# Altium schematic sheet lockdriver(7805).SchDoc
size A2
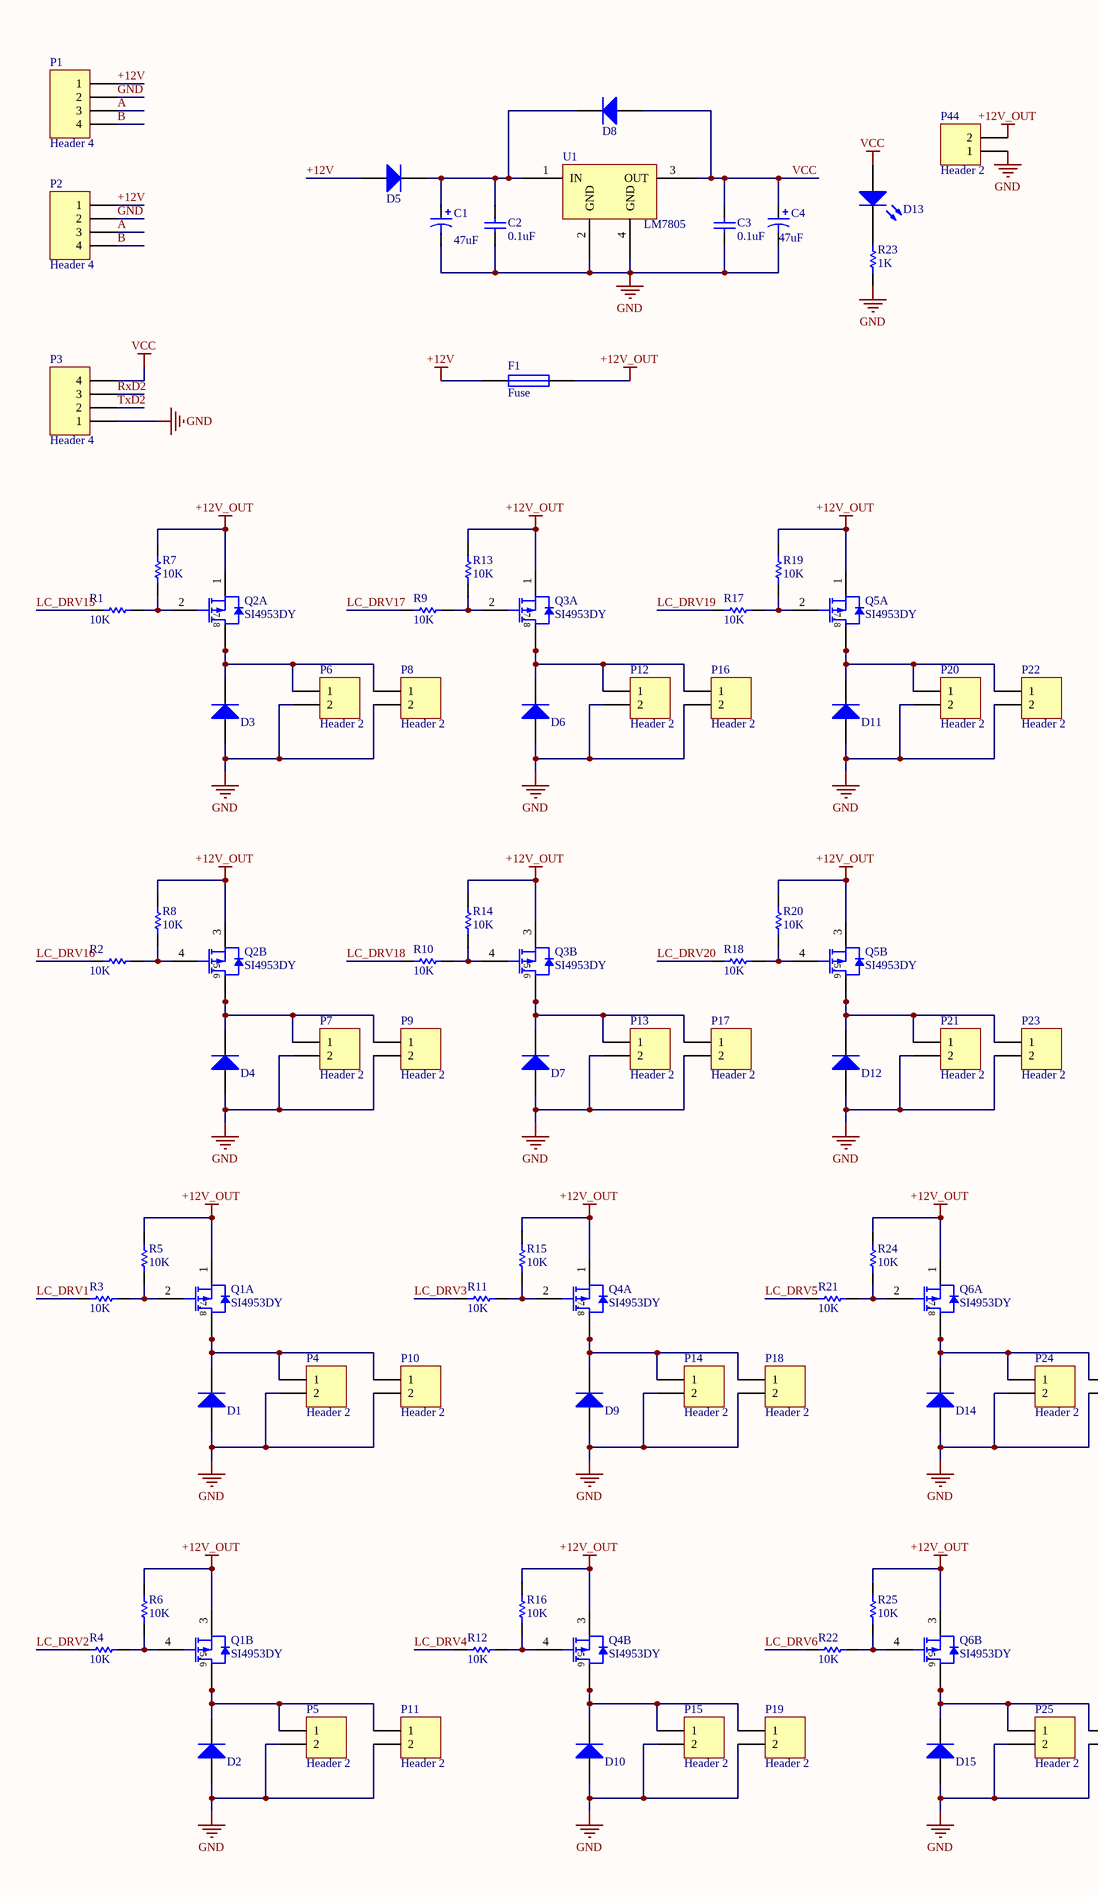
[diagram p0: lockdriver(7805).SchDoc, left]
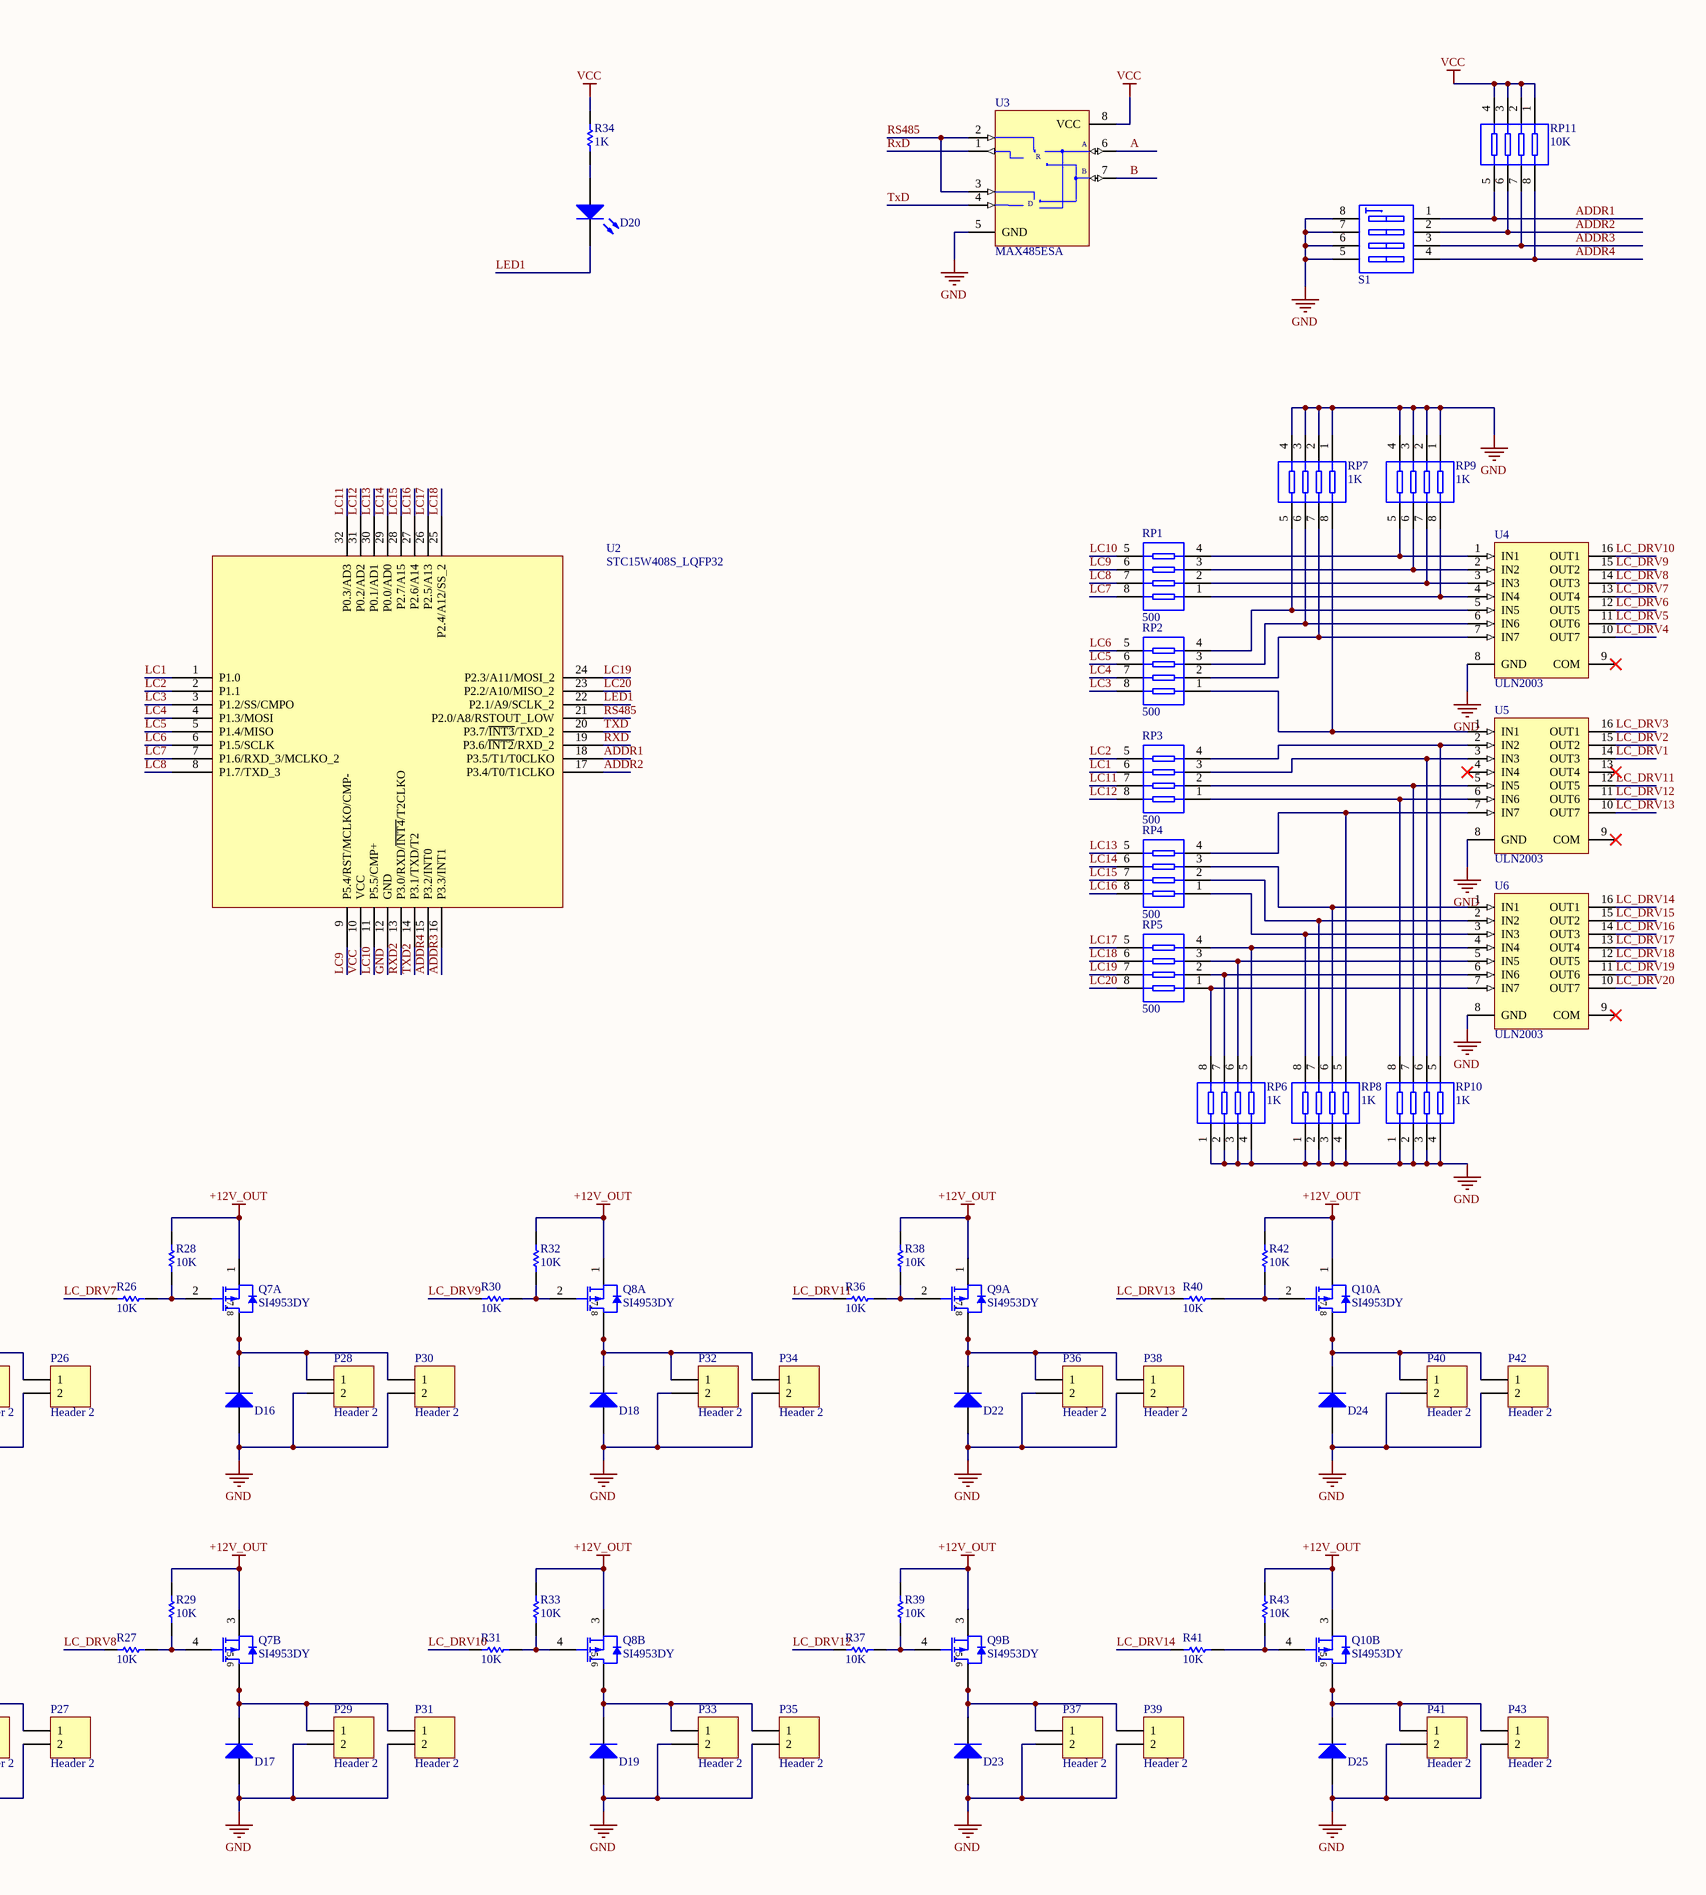
[diagram p1: lockdriver(7805).SchDoc, right]

## Parts
C1  value 47uF  [CAPPR2-5x11.5]  (hidden comment: Cap Pol2)
C2  0.1uF  [CAPC2012M]
C3  0.1uF  [CAPC2012M]
C4  value 47uF  [CAPPR2-5x11.5]  (hidden comment: Cap Pol2)
D1  1N4007  [DSO-C2/X1.8]  (value not drawn)
D2  1N4007  [DSO-C2/X1.8]  (value not drawn)
D3  1N4007  [DSO-C2/X1.8]  (value not drawn)
D4  1N4007  [DSO-C2/X1.8]  (value not drawn)
D5  1N4007  [DSO-C2/X1.8]  (value not drawn)
D6  1N4007  [DSO-C2/X1.8]  (value not drawn)
D7  1N4007  [DSO-C2/X1.8]  (value not drawn)
D8  1N4007  [DSO-C2/X1.8]  (value not drawn)
D9  1N4007  [DSO-C2/X1.8]  (value not drawn)
D10  1N4007  [DSO-C2/X1.8]  (value not drawn)
D11  1N4007  [DSO-C2/X1.8]  (value not drawn)
D12  1N4007  [DSO-C2/X1.8]  (value not drawn)
D13  LED  [LED2012M]  (value not drawn)
D14  1N4007  [DSO-C2/X1.8]  (value not drawn)
D15  1N4007  [DSO-C2/X1.8]  (value not drawn)
D16  1N4007  [DSO-C2/X1.8]  (value not drawn)
D17  1N4007  [DSO-C2/X1.8]  (value not drawn)
D18  1N4007  [DSO-C2/X1.8]  (value not drawn)
D19  1N4007  [DSO-C2/X1.8]  (value not drawn)
D20  LED  [LED2012M]  (value not drawn)
D22  1N4007  [DSO-C2/X1.8]  (value not drawn)
D23  1N4007  [DSO-C2/X1.8]  (value not drawn)
D24  1N4007  [DSO-C2/X1.8]  (value not drawn)
D25  1N4007  [DSO-C2/X1.8]  (value not drawn)
F1  Fuse  [SR075]
P1  Header 4  [VH396-4]
P2  Header 4  [VH396-4]
P3  Header 4  [HDR1X4]
P4  Header 2  [VH396-2]
P5  Header 2  [VH396-2]
P6  Header 2  [VH396-2]
P7  Header 2  [VH396-2]
P8  Header 2  [XH254-2]
P9  Header 2  [XH254-2]
P10  Header 2  [XH254-2]
P11  Header 2  [XH254-2]
P12  Header 2  [VH396-2]
P13  Header 2  [VH396-2]
P14  Header 2  [VH396-2]
P15  Header 2  [VH396-2]
P16  Header 2  [XH254-2]
P17  Header 2  [XH254-2]
P18  Header 2  [XH254-2]
P19  Header 2  [XH254-2]
P20  Header 2  [VH396-2]
P21  Header 2  [VH396-2]
P22  Header 2  [XH254-2]
P23  Header 2  [XH254-2]
P24  Header 2  [VH396-2]
P25  Header 2  [VH396-2]
P26  Header 2  [XH254-2]
P27  Header 2  [XH254-2]
P28  Header 2  [VH396-2]
P29  Header 2  [VH396-2]
P30  Header 2  [XH254-2]
P31  Header 2  [XH254-2]
P32  Header 2  [VH396-2]
P33  Header 2  [VH396-2]
P34  Header 2  [XH254-2]
P35  Header 2  [XH254-2]
P36  Header 2  [VH396-2]
P37  Header 2  [VH396-2]
P38  Header 2  [XH254-2]
P39  Header 2  [XH254-2]
P40  Header 2  [VH396-2]
P41  Header 2  [VH396-2]
P42  Header 2  [XH254-2]
P43  Header 2  [XH254-2]
P44  Header 2  [VH396-2]
Q1  SI4953DY  [SO8_M]  (parts A,B of 2)
Q2  SI4953DY  [SO8_M]  (parts A,B of 2)
Q3  SI4953DY  [SO8_M]  (parts A,B of 2)
Q4  SI4953DY  [SO8_M]  (parts A,B of 2)
Q5  SI4953DY  [SO8_M]  (parts A,B of 2)
Q6  SI4953DY  [SO8_M]  (parts A,B of 2)
Q7  SI4953DY  [SO8_M]  (parts A,B of 2)
Q8  SI4953DY  [SO8_M]  (parts A,B of 2)
Q9  SI4953DY  [SO8_M]  (parts A,B of 2)
Q10  SI4953DY  [SO8_M]  (parts A,B of 2)
R1  10K  [RESC2012M]
R2  10K  [RESC2012M]
R3  10K  [RESC2012M]
R4  10K  [RESC2012M]
R5  10K  [RESC2012M]
R6  10K  [RESC2012M]
R7  10K  [RESC2012M]
R8  10K  [RESC2012M]
R9  10K  [RESC2012M]
R10  10K  [RESC2012M]
R11  10K  [RESC2012M]
R12  10K  [RESC2012M]
R13  10K  [RESC2012M]
R14  10K  [RESC2012M]
R15  10K  [RESC2012M]
R16  10K  [RESC2012M]
R17  10K  [RESC2012M]
R18  10K  [RESC2012M]
R19  10K  [RESC2012M]
R20  10K  [RESC2012M]
R21  10K  [RESC2012M]
R22  10K  [RESC2012M]
R23  1K  [RESC2012M]
R24  10K  [RESC2012M]
R25  10K  [RESC2012M]
R26  10K  [RESC2012M]
R27  10K  [RESC2012M]
R28  10K  [RESC2012M]
R29  10K  [RESC2012M]
R30  10K  [RESC2012M]
R31  10K  [RESC2012M]
R32  10K  [RESC2012M]
R33  10K  [RESC2012M]
R34  1K  [RESC2012M]
R36  10K  [RESC2012M]
R37  10K  [RESC2012M]
R38  10K  [RESC2012M]
R39  10K  [RESC2012M]
R40  10K  [RESC2012M]
R41  10K  [RESC2012M]
R42  10K  [RESC2012M]
R43  10K  [RESC2012M]
RP1  500  [EXB38V]
RP2  500  [EXB38V]
RP3  500  [EXB38V]
RP4  500  [EXB38V]
RP5  500  [EXB38V]
RP6  1K  [EXB38V]
RP7  1K  [EXB38V]
RP8  1K  [EXB38V]
RP9  1K  [EXB38V]
RP10  1K  [EXB38V]
RP11  10K  [EXB38V]
S1  SW DIP-4  [SWITCH-8]  (value not drawn)
U1  LM7805  [SOT223-4M]
U2  STC15W408S_LQFP32  [LQFP32]
U3  MAX485ESA  [SO8_M]
U4  ULN2003  [SO16_M]
U5  ULN2003  [SO16_M]
U6  ULN2003  [SO16_M]

## Nets
+12V: D5.1(A) F1.1 P1.1 P2.1
+12V_OUT: F1.2 P44.2 Q1.1(S) Q1.3(S) Q2.1(S) Q2.3(S) Q3.1(S) Q3.3(S) Q4.1(S) Q4.3(S) Q5.1(S) Q5.3(S) Q6.1(S) Q6.3(S) Q7.1(S) Q7.3(S) Q8.1(S) Q8.3(S) Q9.1(S) Q9.3(S) Q10.1(S) Q10.3(S) R5.2 R6.2 R7.2 R8.2 R13.2 R14.2 R15.2 R16.2 R19.2 R20.2 R24.2 R25.2 R28.2 R29.2 R32.2 R33.2 R38.2 R39.2 R42.2 R43.2
GND: C1.2 C2.1 C3.2 C4.2 D1.1(A) D2.1(A) D3.1(A) D4.1(A) D6.1(A) D7.1(A) D9.1(A) D10.1(A) D11.1(A) D12.1(A) D14.1(A) D15.1(A) D16.1(A) D17.1(A) D18.1(A) D19.1(A) D22.1(A) D23.1(A) D24.1(A) D25.1(A) P1.2 P2.2 P3.1 P4.2 P5.2 P6.2 P7.2 P8.2 P9.2 P10.2 P11.2 P12.2 P13.2 P14.2 P15.2 P16.2 P17.2 P18.2 P19.2 P20.2 P21.2 P22.2 P23.2 P24.2 P25.2 P26.2 P27.2 P28.2 P29.2 P30.2 P31.2 P32.2 P33.2 P34.2 P35.2 P36.2 P37.2 P38.2 P39.2 P40.2 P41.2 P42.2 P43.2 P44.1 R23.1 RP6.1 RP6.2 RP6.3 RP6.4 RP7.1 RP7.2 RP7.3 RP7.4 RP8.1 RP8.2 RP8.3 RP8.4 RP9.1 RP9.2 RP9.3 RP9.4 RP10.1 RP10.2 RP10.3 RP10.4 S1.5(B4) S1.6(B3) S1.7(B2) S1.8(B1) U1.2(GND) U1.4(GND) U2.12(GND) U3.5(GND) U4.8(GND) U5.8(GND) U6.8(GND)
VCC: C3.1 C4.1 D8.1(A) D13.1(A) P3.4 R34.2 RP11.1 RP11.2 RP11.3 RP11.4 U1.3(OUT) U2.10(VCC) U3.8(VCC)
A: P1.3 P2.3 U3.6(A)
ADDR1: RP11.5 S1.1(A1) U2.18(P3.5/T1/T0CLKO)
ADDR2: RP11.6 S1.2(A2) U2.17(P3.4/T0/T1CLKO)
ADDR3: RP11.7 S1.3(A3) U2.16(P3.3/INT1)
ADDR4: RP11.8 S1.4(A4) U2.15(P3.2/INT0)
B: P1.4 P2.4 U3.7(B)
LC1: RP3.6 U2.1(P1.0)
LC2: RP3.5 U2.2(P1.1)
LC3: RP2.8 U2.3(P1.2/SS/CMPO)
LC4: RP2.7 U2.4(P1.3/MOSI)
LC5: RP2.6 U2.5(P1.4/MISO)
LC6: RP2.5 U2.6(P1.5/SCLK)
LC7: RP1.8 U2.7(P1.6/RXD_3/MCLKO_2)
LC8: RP1.7 U2.8(P1.7/TXD_3)
LC9: RP1.6 U2.9(P5.4/RST/MCLKO/CMP-)
LC10: RP1.5 U2.11(P5.5/CMP+)
LC11: RP3.7 U2.32(P0.3/AD3)
LC12: RP3.8 U2.31(P0.2/AD2)
LC13: RP4.5 U2.30(P0.1/AD1)
LC14: RP4.6 U2.29(P0.0/AD0)
LC15: RP4.7 U2.28(P2.7/A15)
LC16: RP4.8 U2.27(P2.6/A14)
LC17: RP5.5 U2.26(P2.5/A13)
LC18: RP5.6 U2.25(P2.4/A12/SS_2)
LC19: RP5.7 U2.24(P2.3/A11/MOSI_2)
LC20: RP5.8 U2.23(P2.2/A10/MISO_2)
LC_DRV1: R3.1 U5.14(OUT3)
LC_DRV2: R4.1 U5.15(OUT2)
LC_DRV3: R11.1 U5.16(OUT1)
LC_DRV4: R12.1 U4.10(OUT7)
LC_DRV5: R21.1 U4.11(OUT6)
LC_DRV6: R22.1 U4.12(OUT5)
LC_DRV7: R26.1 U4.13(OUT4)
LC_DRV8: R27.1 U4.14(OUT3)
LC_DRV9: R30.1 U4.15(OUT2)
LC_DRV10: R31.1 U4.16(OUT1)
LC_DRV11: R36.1 U5.12(OUT5)
LC_DRV12: R37.1 U5.11(OUT6)
LC_DRV13: R40.1 U5.10(OUT7)
LC_DRV14: R41.1 U6.16(OUT1)
LC_DRV15: R1.1 U6.15(OUT2)
LC_DRV16: R2.1 U6.14(OUT3)
LC_DRV17: R9.1 U6.13(OUT4)
LC_DRV18: R10.1 U6.12(OUT5)
LC_DRV19: R17.1 U6.11(OUT6)
LC_DRV20: R18.1 U6.10(OUT7)
LED1: D20.2(K) U2.22(P2.1/A9/SCLK_2)
RS485: U2.21(P2.0/A8/RSTOUT_LOW) U3.2(~{RE}) U3.3(DE)
RxD: U2.19(P3.6/~{INT2}/RXD_2) U3.1(RO)
RxD2: P3.3 U2.13(P3.0/RXD/~{INT4}/T2CLKO)
TxD: U2.20(P3.7/~{INT3}/TXD_2) U3.4(DI)
TxD2: P3.2 U2.14(P3.1/TXD/T2)
NetC1_1: C1.1 C2.2 D5.2(K) D8.2(K) U1.1(IN)
NetD1_2: D1.2(K) P4.1 P10.1 Q1.7(D) Q1.8(D)
NetD2_2: D2.2(K) P5.1 P11.1 Q1.5(D) Q1.6(D)
NetD3_2: D3.2(K) P6.1 P8.1 Q2.7(D) Q2.8(D)
NetD4_2: D4.2(K) P7.1 P9.1 Q2.5(D) Q2.6(D)
NetD6_2: D6.2(K) P12.1 P16.1 Q3.7(D) Q3.8(D)
NetD7_2: D7.2(K) P13.1 P17.1 Q3.5(D) Q3.6(D)
NetD9_2: D9.2(K) P14.1 P18.1 Q4.7(D) Q4.8(D)
NetD10_2: D10.2(K) P15.1 P19.1 Q4.5(D) Q4.6(D)
NetD11_2: D11.2(K) P20.1 P22.1 Q5.7(D) Q5.8(D)
NetD12_2: D12.2(K) P21.1 P23.1 Q5.5(D) Q5.6(D)
NetD13_2: D13.2(K) R23.2
NetD14_2: D14.2(K) P24.1 P26.1 Q6.7(D) Q6.8(D)
NetD15_2: D15.2(K) P25.1 P27.1 Q6.5(D) Q6.6(D)
NetD16_2: D16.2(K) P28.1 P30.1 Q7.7(D) Q7.8(D)
NetD17_2: D17.2(K) P29.1 P31.1 Q7.5(D) Q7.6(D)
NetD18_2: D18.2(K) P32.1 P34.1 Q8.7(D) Q8.8(D)
NetD19_2: D19.2(K) P33.1 P35.1 Q8.5(D) Q8.6(D)
NetD20_1: D20.1(A) R34.1
NetD22_2: D22.2(K) P36.1 P38.1 Q9.7(D) Q9.8(D)
NetD23_2: D23.2(K) P37.1 P39.1 Q9.5(D) Q9.6(D)
NetD24_2: D24.2(K) P40.1 P42.1 Q10.7(D) Q10.8(D)
NetD25_2: D25.2(K) P41.1 P43.1 Q10.5(D) Q10.6(D)
NetQ1_2: Q1.2(G) R3.2 R5.1
NetQ1_4: Q1.4(G) R4.2 R6.1
NetQ2_2: Q2.2(G) R1.2 R7.1
NetQ2_4: Q2.4(G) R2.2 R8.1
NetQ3_2: Q3.2(G) R9.2 R13.1
NetQ3_4: Q3.4(G) R10.2 R14.1
NetQ4_2: Q4.2(G) R11.2 R15.1
NetQ4_4: Q4.4(G) R12.2 R16.1
NetQ5_2: Q5.2(G) R17.2 R19.1
NetQ5_4: Q5.4(G) R18.2 R20.1
NetQ6_2: Q6.2(G) R21.2 R24.1
NetQ6_4: Q6.4(G) R22.2 R25.1
NetQ7_2: Q7.2(G) R26.2 R28.1
NetQ7_4: Q7.4(G) R27.2 R29.1
NetQ8_2: Q8.2(G) R30.2 R32.1
NetQ8_4: Q8.4(G) R31.2 R33.1
NetQ9_2: Q9.2(G) R36.2 R38.1
NetQ9_4: Q9.4(G) R37.2 R39.1
NetQ10_2: Q10.2(G) R40.2 R42.1
NetQ10_4: Q10.4(G) R41.2 R43.1
NetRP1_1: RP1.1 RP9.8 U4.4(IN4)
NetRP1_2: RP1.2 RP9.7 U4.3(IN3)
NetRP1_3: RP1.3 RP9.6 U4.2(IN2)
NetRP1_4: RP1.4 RP9.5 U4.1(IN1)
NetRP2_1: RP2.1 RP7.8 U5.1(IN1)
NetRP2_2: RP2.2 RP7.7 U4.7(IN7)
NetRP2_3: RP2.3 RP7.6 U4.6(IN6)
NetRP2_4: RP2.4 RP7.5 U4.5(IN5)
NetRP3_1: RP3.1 RP10.8 U5.6(IN6)
NetRP3_2: RP3.2 RP10.7 U5.5(IN5)
NetRP3_3: RP3.3 RP10.6 U5.3(IN3)
NetRP3_4: RP3.4 RP10.5 U5.2(IN2)
NetRP4_1: RP4.1 RP8.8 U6.3(IN3)
NetRP4_2: RP4.2 RP8.7 U6.2(IN2)
NetRP4_3: RP4.3 RP8.6 U6.1(IN1)
NetRP4_4: RP4.4 RP8.5 U5.7(IN7)
NetRP5_1: RP5.1 RP6.8 U6.7(IN7)
NetRP5_2: RP5.2 RP6.7 U6.6(IN6)
NetRP5_3: RP5.3 RP6.6 U6.5(IN5)
NetRP5_4: RP5.4 RP6.5 U6.4(IN4)

Not connected (* = marked no-connect by the designer): U4 9(COM)*; U5 4(IN4)* 9(COM)* 13(OUT4)*; U6 9(COM)*

## Notes on the sheet
- (in symbol MAX485ESA) R; D
- (in symbol SI4953DY, part A) 7, 8
- (in symbol SI4953DY, part B) 5, 6

## Library data of the parts
C1 C4 = Cap Pol2: Polarized Capacitor (22uf-47uf); Published: 8-Jun-2000; LatestRevisionDate: 17-Jul-2002; LatestRevisionNote: Re-released for DXP Platform.; Publisher: Altium Limited; PackageDescription: Polarized Capacitor; 2 Leads
C2 C3 = Cap: Capacitor; Published: 8-Jun-2000; LatestRevisionDate: 17-Jul-2002; LatestRevisionNote: Re-released for DXP Platform.; PackageReference: RAD-0.3; Publisher: Altium Limited; PackageDescription: Radial Cap, Thru-Hole; 2 Leads; 0.3 in Pin Spacing; Value: 0.1uF
D1-D12 D14-D19 D22-D25 = Diode: Default Diode; Published: 8-Jun-2000; LatestRevisionDate: 17-Jul-2002; LatestRevisionNote: Re-released for DXP Platform.; PackageVersion: Sep-1996; PackageReference: SMC; Publisher: Altium Limited; PackageDescription: DO-214-AB/SMC; 2 C-Bend Leads; Body 7.9 x 5.9 mm, inc. leads (LxW); Code_JEDEC: DO-214-AB; Value: 1N4007
D13 D20 = LED: Typical INFRARED GaAs LED; Published: 8-Jun-2000; LatestRevisionDate: 08-Jul-2005; LatestRevisionNote: Mech Layer 1 removed.; PackageReference: LED-0; Publisher: Altium Limited; PackageDescription: LED; 2 Leads
P1-P3 = Header 4: Header, 4-Pin; LatestRevisionDate: 17-Jul-2002; LatestRevisionNote: Re-released for DXP Platform.; Publisher: Altium Limited
P4-P44 = Header 2: Header, 2-Pin; LatestRevisionDate: 17-Jul-2002; LatestRevisionNote: Re-released for DXP Platform.; Publisher: Altium Limited
Q1-Q10 = SI4953DY: Dual P-Channel 30V (D-S) Rated  MOSFET; Published: 8-Jun-2000; LatestRevisionDate: 13-Apr-2006; LatestRevisionNote: IPC-7351 Footprint Added.; DatasheetVersion: 6-Oct-1997; PackageVersion: Aug-1998; PackageReference: SO-8; Publisher: Altium Limited; PackageDescription: 8-Pin Small Outline Integrated Circuit 1.27 mm Pitch; ComponentLink1Description: Manufacturer Link; ComponentLink1URL: http://www.vishay.com/; ComponentLink2Description: Datasheet; ComponentLink2URL: http://www.vishay.com/docs/70153/70153.pdf
R1-R34 R36-R43 = Res: Resistor; Published: 8-Jun-2000; LatestRevisionDate: 17-Jul-2002; LatestRevisionNote: Re-released for DXP Platform.; PackageReference: AXIAL-0.3; Publisher: Altium Limited; PackageDescription: Axial Device, Thru-Hole; 2 Leads; 0.3 in Pin Spacing
  R1-R22 R24-R33 R36-R43: Value: 10K
  R23 R34: Value: 1K
RP1-RP11 = Res Pack
  RP1-RP5: Value: 500
  RP6-RP10: Value: 1K
  RP11: Value: 10K
S1 = SW DIP-4: DIP Switch, 4 Position, SPST; Published: 24-Mar-1999; LatestRevisionDate: 29-May-2009; LatestRevisionNote: IPC-7351 Footprint Added.; PackageVersion: Dec-2002; PackageReference: SO8; Publisher: Altium Limited; PackageDescription: 8-Pin Small Outline Integrated Circuit 1.27 mm Pitch; Code_JEDEC: MS-012-AA; Code_IPC: SOIC127P600-8
U3 = MAX485ESA: Low-Power, Slew-Rate-Limited RS-485/RS-422 Transceiver; Published: 16-Jan-2001; LatestRevisionDate: 13-Apr-2006; LatestRevisionNote: IPC-7351 Footprint Added.; DatasheetVersion: Feb-1996; PackageReference: NSO8; Publisher: Altium Limited; PackageDescription: 8-Pin Small Outline Integrated Circuit 1.27 mm Pitch; Code_JEDEC: MS-012-AA; Code_IPC: SOIC127P600-8; ComponentLink1Description: Manufacturer Link; ComponentLink1URL: http://www.maxim-ic.com/; ComponentLink2Description: Datasheet; ComponentLink2URL: http://pdfserv.maxim-ic.com/en/ds/MAX1487-MAX491.pdf
U4-U6 = ULN2003: Seven Darlington Array; Published: 8-Jun-2000; LatestRevisionDate: 13-Apr-2006; LatestRevisionNote: IPC-7351 Footprint Added.; DatasheetVersion: Sep-1998; PackageVersion: May-1998; PackageReference: SO16; Publisher: Altium Limited; PackageDescription: 16-Pin Small Outline Integrated Circuit 1.27 mm Pitch; Code_IPC: SOIC127P600-16; ComponentLink1Description: Manufacturer Link; ComponentLink1URL: http://www.st.com/; ComponentLink2Description: Datasheet; ComponentLink2URL: http://www.st.com/stonline/products/literature/ds/5279/uln2001.pdf
F1 = Fuse: Published: 8-Jun-2000; LatestRevisionDate: 17-Jul-2002; LatestRevisionNote: Re-released for DXP Platform.; PackageReference: PIN-W2/E2.8; Publisher: Altium Limited; PackageDescription: Thru-Hole; 2 Leads